# Altium schematic sheet Sheet_1.schdoc
size 316 x 214 mm
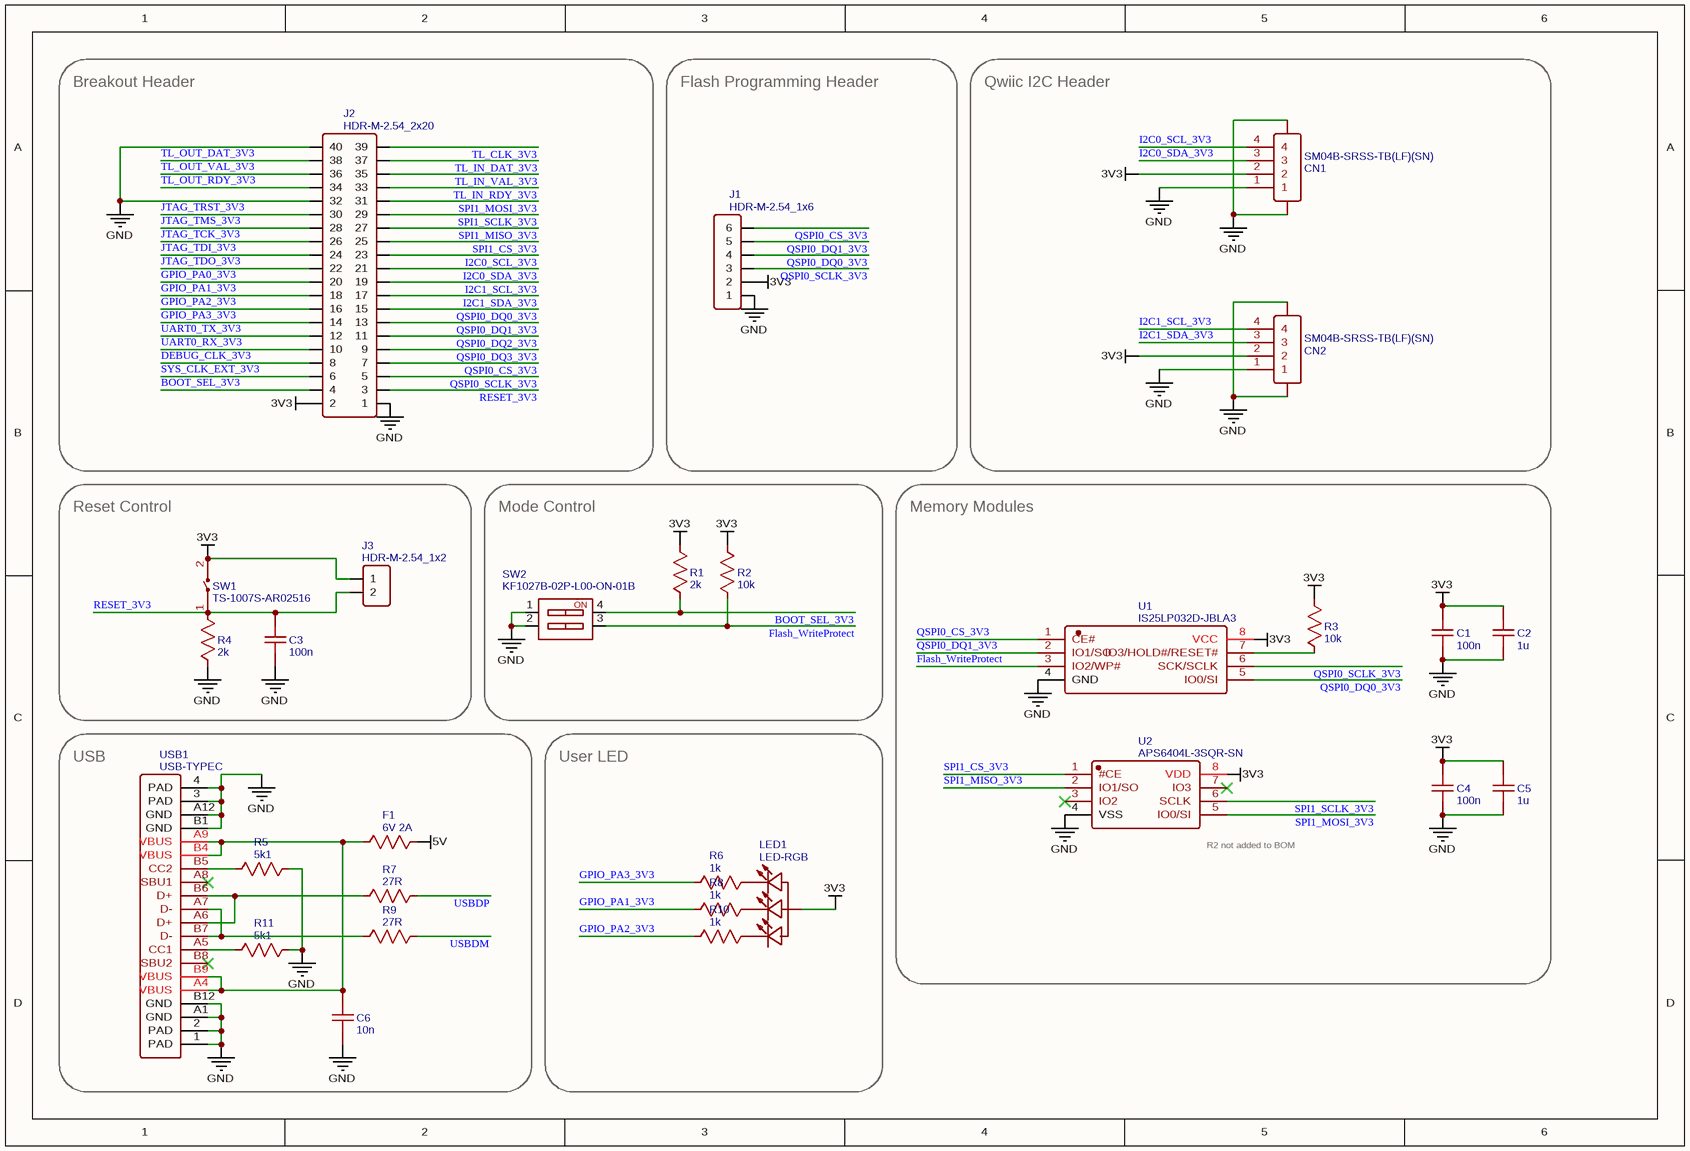
[diagram p0: Sheet_1.schdoc]

## Parts
C1  100n  [CAPA-0402]
C2  1u  [CAPA-0402]
C3  100n  [CAPA-0402]
C4  100n  [CAPA-0402]
C5  1u  [CAPA-0402]
C6  10n  [CAPA-0402]
CN1  SM04B-SRSS-TB(LF)(SN)  [CONN-SMD_4P-P1.00_SM04B-SRSS-TB-LF-SN]
CN2  SM04B-SRSS-TB(LF)(SN)  [CONN-SMD_4P-P1.00_SM04B-SRSS-TB-LF-SN]
F1  6V 2A  [R0805]
J1  HDR-M-2.54_1x6  [HDR-M-2.54_1X6]
J2  HDR-M-2.54_2x20  [HDR-M-2.54_2X20]
J3  HDR-M-2.54_1x2  [HDR-M-2.54_1X2]
LED1  LED-RGB  [LED-ARRAY-SMD_4P-L3.2-W2.7-TL-RD_TJ-S3528]
R1  2k  [RES-0402]
R2  10k  [RES-0402]
R3  10k  [RES-0402]
R4  2k  [RES-0402]
R5  5k1  [RES-0402]
R6  1k  [RES-0402]
R7  27R  [RES-0402]
R8  1k  [RES-0402]
R9  27R  [RES-0402]
R10  1k  [RES-0402]
R11  5k1  [RES-0402]
SW1  TS-1007S-AR02516  [SW-SMD_L6.1-W3.6-LS7.9]
SW2  KF1027B-02P-L00-ON-01B  [SW-SMD_4P-L6.1-W6.2-P2.54-LS10.0]
U1  IS25LP032D-JBLA3  [SOIC-8_L5.3-W5.3-P1.27-LS7.9-BL]
U2  APS6404L-3SQR-SN  [SOIC-8_L5.0-W4.0-P1.27-LS6.0-TL]
USB1  USB-TYPEC  [USB-C-SMD_KH-TYPE-C-16P]

## Blocks framed on the sheet
Breakout Header: J2
Flash Programming Header: J1
Qwiic I2C Header: CN1 CN2
Reset Control: C3 J3 R4 SW1
Mode Control: R1 R2 SW2
Memory Modules: C1 C2 C4 C5 R3 U1 U2
USB: C6 F1 R5 R7 R9 R11 USB1
User LED: LED1 R6 R8 R10

## Nets
3V3: C1.2 C2.2 C4.2 C5.2 CN1.2 CN2.2 J1.2 J2.2 J3.1 LED1.4(+) R1.2 R2.2 R3.2 SW1.2 U1.8(VCC) U2.8(VDD)
5V: F1.2
GND: C1.1 C2.1 C3.1 C4.1 C5.1 C6.1 CN1.1 CN1.5 CN1.6 CN2.1 CN2.5 CN2.6 J1.1 J2.1 J2.32 J2.40 R4.1 R5.2 R11.2 SW2.1(A1) SW2.2(A2) U1.4(GND) U2.4(VSS) USB1.1(PAD) USB1.2(PAD) USB1.3(PAD) USB1.4(PAD) USB1.A1(GND) USB1.A12(GND) USB1.B1(GND) USB1.B12(GND)
BOOT_SEL_3V3: J2.4 R1.1 SW2.4(A4)
DEBUG_CLK_3V3: J2.8
Flash_WriteProtect: R2.1 SW2.3(A3) U1.3(IO2/WP#)
GPIO_PA0_3V3: J2.20
GPIO_PA1_3V3: J2.18 R8.2
GPIO_PA2_3V3: J2.16 R10.2
GPIO_PA3_3V3: J2.14 R6.2
I2C0_SCL_3V3: CN1.4 J2.23
I2C0_SDA_3V3: CN1.3 J2.21
I2C1_SCL_3V3: CN2.4 J2.19
I2C1_SDA_3V3: CN2.3 J2.17
JTAG_TCK_3V3: J2.26
JTAG_TDI_3V3: J2.24
JTAG_TDO_3V3: J2.22
JTAG_TMS_3V3: J2.28
JTAG_TRST_3V3: J2.30
QSPI0_CS_3V3: J1.6 J2.7 U1.1(CE#)
QSPI0_DQ0_3V3: J1.4 J2.15 U1.5(IO0/SI)
QSPI0_DQ1_3V3: J1.5 J2.13 U1.2(IO1/SO)
QSPI0_DQ2_3V3: J2.11
QSPI0_DQ3_3V3: J2.9
QSPI0_SCLK_3V3: J1.3 J2.5 U1.6(SCK/SCLK)
RESET_3V3: C3.2 J2.3 J3.2 R4.2 SW1.1
SPI1_CS_3V3: J2.25 U2.1(#CE)
SPI1_MISO_3V3: J2.27 U2.2(IO1/SO)
SPI1_MOSI_3V3: J2.31 U2.5(IO0/SI)
SPI1_SCLK_3V3: J2.29 U2.6(SCLK)
SYS_CLK_EXT_3V3: J2.6
TL_CLK_3V3: J2.39
TL_IN_DAT_3V3: J2.37
TL_IN_RDY_3V3: J2.33
TL_IN_VAL_3V3: J2.35
TL_OUT_DAT_3V3: J2.38
TL_OUT_RDY_3V3: J2.34
TL_OUT_VAL_3V3: J2.36
UART0_RX_3V3: J2.10
UART0_TX_3V3: J2.12
USBDM: R9.2
USBDP: R7.2
NetC6_2: C6.2 F1.1 USB1.A4(VBUS) USB1.A9(VBUS) USB1.B4(VBUS) USB1.B9(VBUS)
NetLED1_1: LED1.1(-) R8.1
NetLED1_2: LED1.2(-) R10.1
NetLED1_3: LED1.3(-) R6.1
NetR3_1: R3.1 U1.7(IO3/HOLD#/RESET#)
NetR5_1: R5.1 USB1.B5(CC2)
NetR7_1: R7.1 USB1.A6(D+) USB1.B6(D+)
NetR9_1: R9.1 USB1.A7(D-) USB1.B7(D-)
NetR11_1: R11.1 USB1.A5(CC1)

Not connected (* = marked no-connect by the designer): U2 3(IO2)* 7(IO3)*; USB1 A8(SBU1)* B8(SBU2)*

## Notes on the sheet
- (near U2) R2 not added to BOM
- (in symbol KF1027B-02P-L00-ON-01B) ON

## Library data of the parts
C1 C3 C4 = 100n: BOM_Manufacturer Part: CL05B104KB54PNC; BOM_Manufacturer: SAMSUNG; nameAlias: Value(F); BOM_Supplier Part: C307331; BOM_Supplier: LCSC; link: https://atta.szlcsc.com//upload/public/pdf/source/20160103/1457707735223.pdf; spicePre: C; spiceSymbolName: CAPA-0402_100n
C2 C5 = 1u: BOM_Manufacturer Part: CL05A105KA5NQNC; BOM_Manufacturer: SAMSUNG; nameAlias: Value(F); BOM_Supplier Part: C52923; BOM_Supplier: LCSC; link: https://atta.szlcsc.com//upload/public/pdf/source/20160103/1457707735223.pdf; spicePre: C; spiceSymbolName: CAPA-0402_1u
C6 = 10n: BOM_Manufacturer Part: CL05B103KB5NNNC; BOM_Manufacturer: SAMSUNG; nameAlias: Value(F); BOM_Supplier Part: C15195; BOM_Supplier: LCSC; link: https://atta.szlcsc.com//upload/public/pdf/source/20160103/1457707735223.pdf; spicePre: C; spiceSymbolName: CAPA-0402_10n
CN1 CN2 = SM04B-SRSS-TB(LF)(SN): BOM_Manufacturer: JST; BOM_Supplier: LCSC; BOM_Supplier Part: C160404; BOM_Manufacturer Part: SM04B-SRSS-TB(LF)(SN); BOM_JLCPCB Part Class: Extended Part; link: https://www.jst-mfg.com/product/pdf/eng/eSH.pdf; spicePre: C; spiceSymbolName: SM04B-SRSS-TB(LF)(SN)
F1 = 6V 2A: BOM_Manufacturer Part: SL0805200; BOM_Manufacturer: TECHFUSE; nameAlias: Value(Ω); Contributor: LCEDA_Lib; BOM_Supplier Part: C70158; BOM_Supplier: LCSC; spicePre: R; spiceSymbolName: R_1206_US
J1 = HDR-M-2.54_1x6: Contributor: LCEDA_Lib; BOM_Supplier Part: C190819; BOM_Supplier: LCSC; spicePre: J; spiceSymbolName: HDR-M-2.54_1x6
J2 = HDR-M-2.54_2x20: Contributor: LCEDA_Lib; BOM_Supplier Part: C50980; BOM_Supplier: LCSC; spicePre: J; spiceSymbolName: HDR-M-2.54_2x20
J3 = HDR-M-2.54_1x2: Contributor: LCEDA_Lib; BOM_Supplier Part: C124375; BOM_Supplier: LCSC; spicePre: J; spiceSymbolName: HDR-M-2.54_1x2
LED1 = LED-RGB: BOM_Manufacturer: TOGIALED; BOM_Manufacturer Part: TJ-S3528UG2W9TLCCYRGB-A5; BOM_Supplier: LCSC; BOM_Supplier Part: C601699; JLCPCB Part Class: Extended Part; BOM_JLCPCB Part Class: Extended Part; spicePre: L; spiceSymbolName: LED-RGB
R1 R4 = 2k: BOM_Manufacturer Part: 0402WGF2001TCE; BOM_Manufacturer: UniOhm 台湾厚声; nameAlias: Value(Ω); BOM_Supplier Part: C4109; BOM_Supplier: LCSC; link: https://atta.szlcsc.com//upload/public/pdf/source/20200306/C422600_1E6D84923E4A46A82E41ADD87F860B5C.pdf; spicePre: R; spiceSymbolName: RES-0402_2k
R2 R3 = 10k: BOM_Manufacturer Part: 0402WGF1002TCE; BOM_Manufacturer: UniOhm 台湾厚声; nameAlias: Value(Ω); BOM_Supplier Part: C25744; BOM_Supplier: LCSC; link: https://atta.szlcsc.com//upload/public/pdf/source/20200306/C422600_1E6D84923E4A46A82E41ADD87F860B5C.pdf; spicePre: R; spiceSymbolName: RES-0402_10k
R5 R11 = 5k1: BOM_Manufacturer Part: 0402WGF5101TCE; BOM_Manufacturer: UniOhm 台湾厚声; nameAlias: Value(Ω); BOM_Supplier Part: C25905; BOM_Supplier: LCSC; link: https://atta.szlcsc.com//upload/public/pdf/source/20200306/C422600_1E6D84923E4A46A82E41ADD87F860B5C.pdf; spicePre: R; spiceSymbolName: RES-0402_5k1
R6 R8 R10 = 1k: BOM_Manufacturer Part: 0402WGF1001TCE; BOM_Manufacturer: UniOhm 台湾厚声; nameAlias: Value(Ω); BOM_Supplier Part: C11702; BOM_Supplier: LCSC; link: https://atta.szlcsc.com//upload/public/pdf/source/20200306/C422600_1E6D84923E4A46A82E41ADD87F860B5C.pdf; spicePre: R; spiceSymbolName: RES-0402_1k
R7 R9 = 27R: BOM_Manufacturer Part: RCT0227RJLF; BOM_Manufacturer: HKR; nameAlias: Value(Ω); BOM_Supplier Part: C174257; BOM_Supplier: LCSC; link: https://atta.szlcsc.com//upload/public/pdf/source/20180228/C174257_15197988724151376247.pdf; spicePre: R; spiceSymbolName: RES-0402_27R
SW1 = TS-1007S-AR02516: BOM_Manufacturer: XUNPU; Contributor: LCSC; BOM_Supplier: LCSC; BOM_Supplier Part: C720381; BOM_Manufacturer Part: TS-1007S-AR02516; BOM_JLCPCB Part Class: Extended Part; spicePre: S; spiceSymbolName: TS-1007S-AR02516
SW2 = KF1027B-02P-L00-ON-01B: BOM_Manufacturer: 凯峰; Contributor: LCSC; BOM_Supplier: LCSC; BOM_Supplier Part: C976353; BOM_Manufacturer Part: KF1027B-02P-L00-ON-01B; BOM_JLCPCB Part Class: Extended Part; spicePre: S; spiceSymbolName: KF1027B-02P-L00-ON-01B
U1 = IS25LP032D-JBLA3: BOM_Manufacturer: ISSI(美国芯成); BOM_Supplier: LCSC; BOM_Supplier Part: C1236833; BOM_Manufacturer Part: IS25LP032D-JBLA3; link: https://atta.szlcsc.com/upload/public/pdf/source/20210604/C336180_C8FCD192C523CC64A79435C5A1C7C288.pdf; BOM_JLCPCB Part Class: Extended Part; spicePre: U; spiceSymbolName: IS25LP032D-JBLA3
U2 = APS6404L-3SQR-SN: BOM_Manufacturer: null; BOM_Supplier: LCSC; BOM_Supplier Part: C9900003354; BOM_Manufacturer Part: APS6404L-3SQR-SN; link: https://img.jlc.com/pdf/applyPasteComponent/2021-12-06/31098A/66796366ab5e49f0a48d07582eff2f2b/APS6404L-3SQR-SN.pdf; BOM_JLCPCB Part Class: Extended Part; spicePre: U; spiceSymbolName: APS6404L-3SQR-SN
USB1 = USB-TYPEC: BOM_Manufacturer: Shenzhen Kinghelm Elec; BOM_Manufacturer Part: KH-TYPE-C-16P; Contributor: T-K-233; BOM_Supplier: LCSC; BOM_Supplier Part: C709357; link: https://atta.szlcsc.com/upload/public/pdf/source/20211022/DACD6552F639E9483017DE6DC0E61150.pdf; spicePre: U; spiceSymbolName: USB-TYPEC